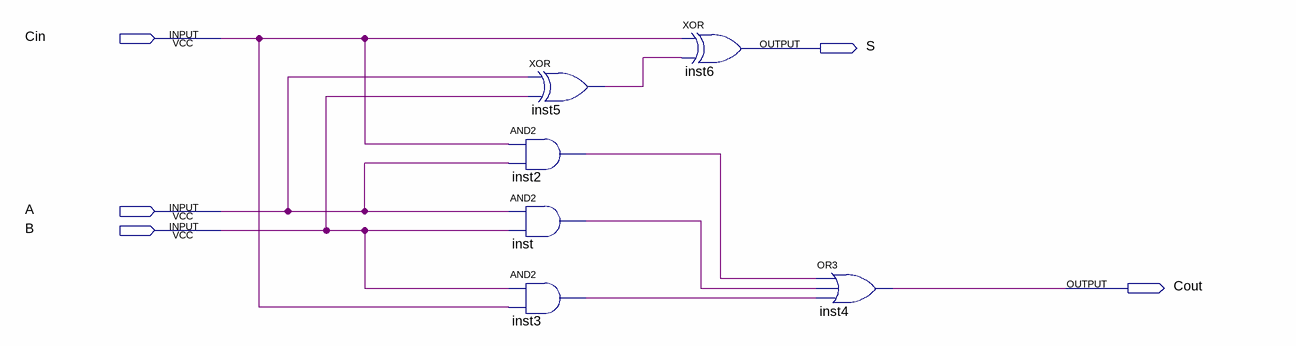
[diagram p0: schematic sheet]
// Quartus schematic soma1.bdf as structural Verilog: 6 symbols, 5 pins
module soma1 (
  input  Cin,
  input  A,
  input  B,
  output S,
  output Cout
);

  wire inst2_out, inst3_out, inst5_out, inst_out;

  xor inst5 (inst5_out, A, B);
  and inst2 (inst2_out, Cin, A);
  and inst (inst_out, A, B);
  and inst3 (inst3_out, B, Cin);
  xor inst6 (S, Cin, inst5_out);
  or inst4 (Cout, inst2_out, inst_out, inst3_out);
endmodule
